# Altium schematic sheet Split_propu2026.SchDoc
size A4; SheetNumber: 1; SheetTotal: 1
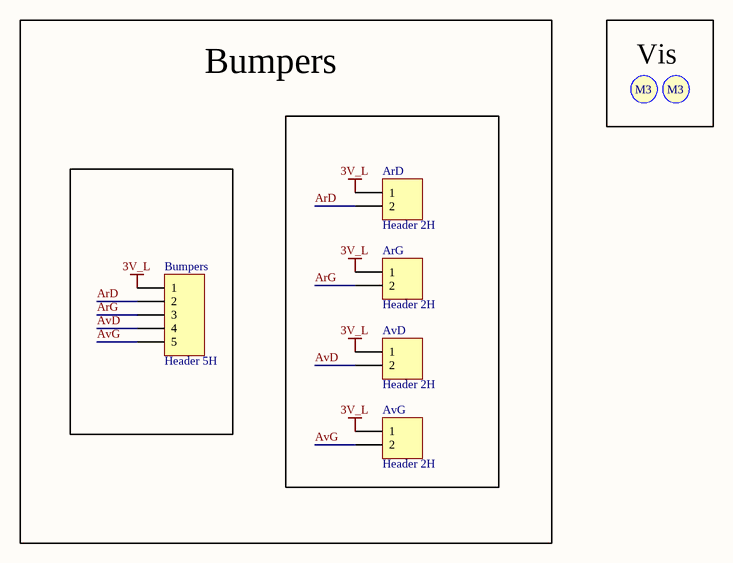
[diagram p0: Split_propu2026.SchDoc]

## Parts
ArD  Header 2H  [S2B-XH-A]
ArG  Header 2H  [S2B-XH-A]
AvD  Header 2H  [S2B-XH-A]
AvG  Header 2H  [S2B-XH-A]
Bumpers  Header 5H  [S5B-XH-A]
S0  Screw M3  [Screw M3]  (value not drawn)
S1  Screw M3  [Screw M3]  (value not drawn)

## Nets
3V_L: ArD.1 ArG.1 AvD.1 AvG.1 Bumpers.1
ArD: ArD.2 Bumpers.2
ArG: ArG.2 Bumpers.3
AvD: AvD.2 Bumpers.4
AvG: AvG.2 Bumpers.5

## Notes on the sheet
- Bumpers
- Vis
- (near ArD) Extérieur
- Carte Action
- (in symbol Screw M3) M3

## Library data of the parts
ArD ArG AvD AvG = Header 2H: Header, 2-Pin, Right Angle; LatestRevisionDate: 17-Jul-2002; LatestRevisionNote: Re-released for DXP Platform.; Publisher: Altium Limited
Bumpers = Header 5H: Header, 5-Pin, Right Angle; LatestRevisionDate: 17-Jul-2002; LatestRevisionNote: Re-released for DXP Platform.; Publisher: Altium Limited